# EAGLE design LB_BIT_1OUT-XL-v03(1_1x) (EAGLE 6.5.0)
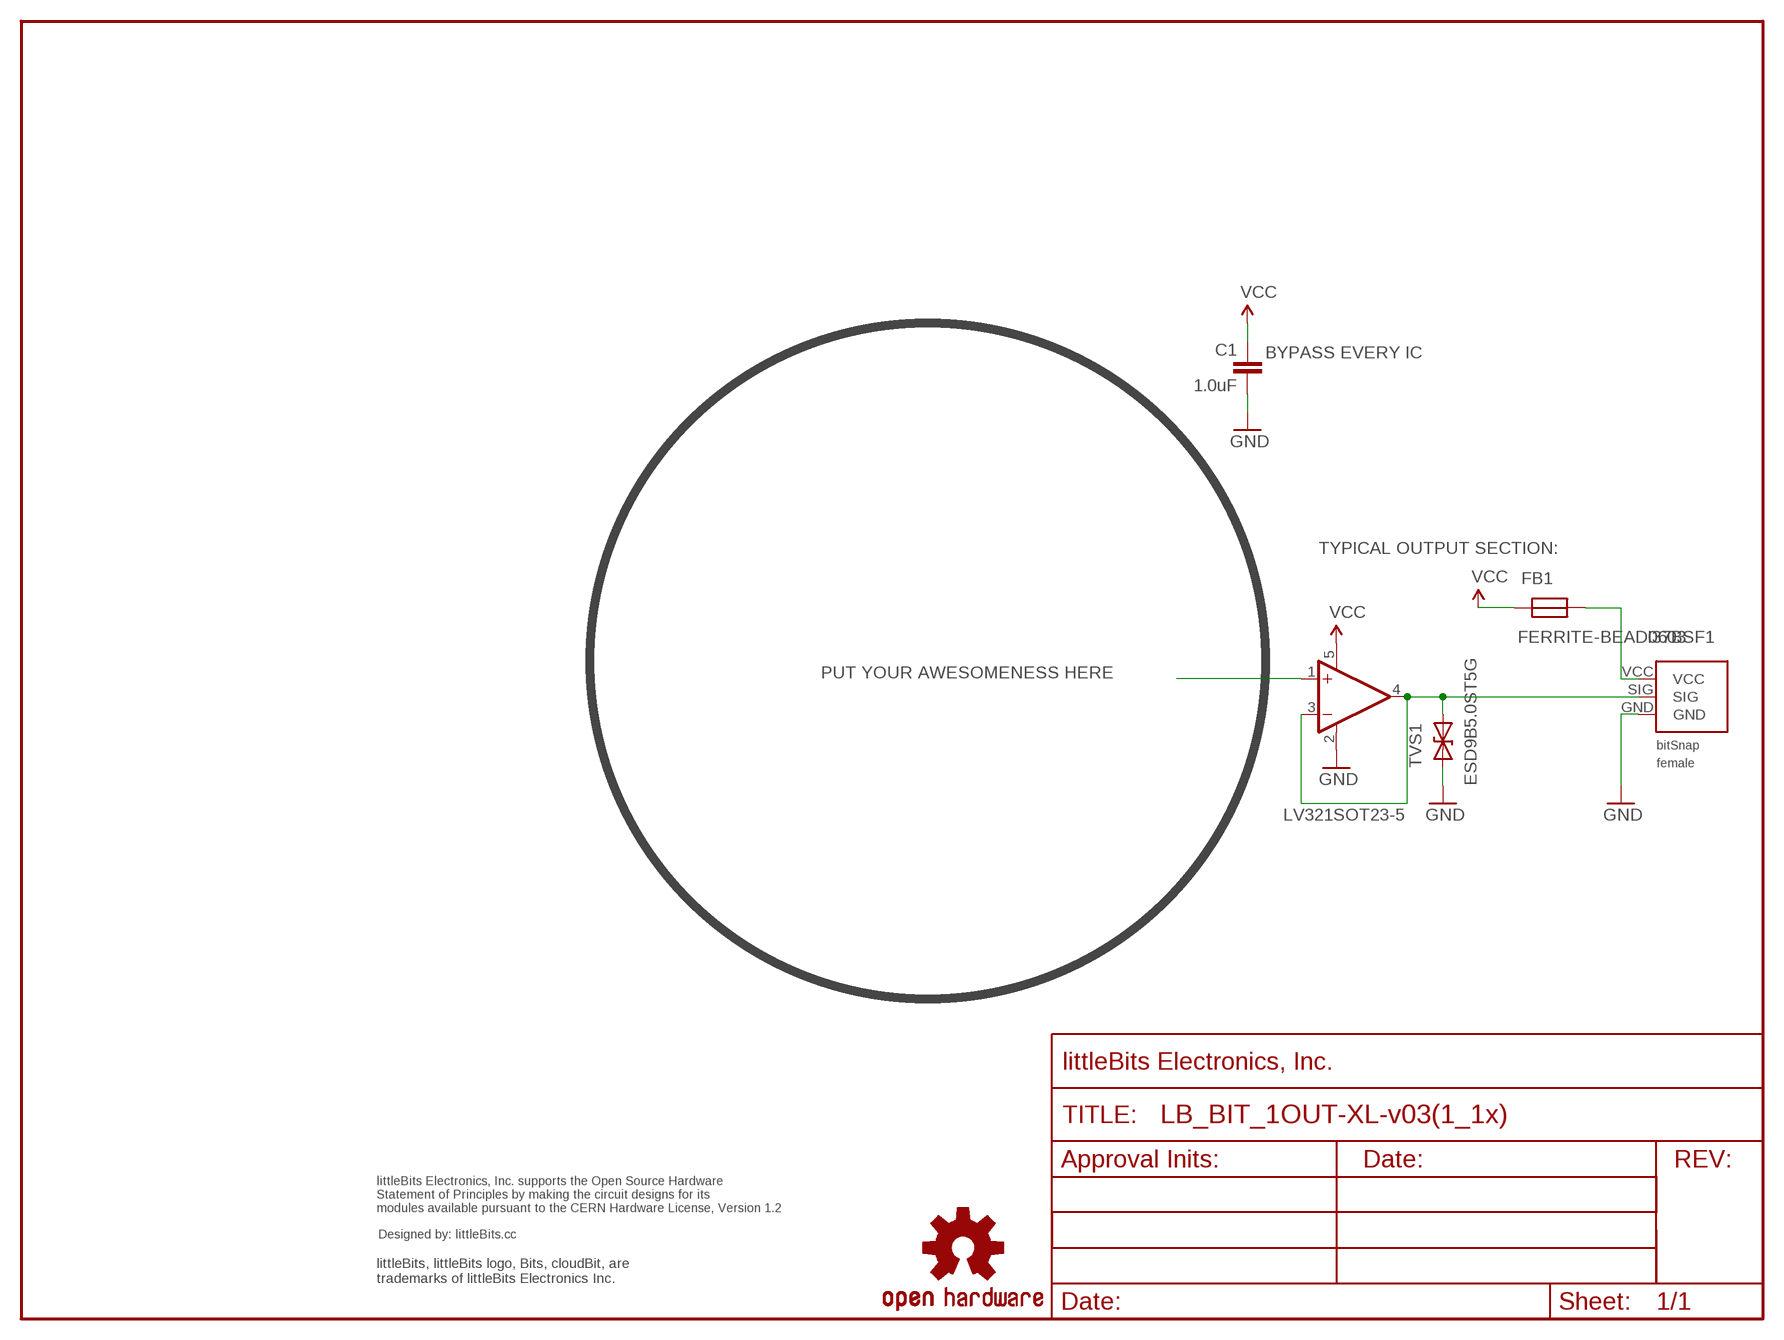
[diagram p0: schematic, sheet 1]

## Parts
C1  1.0uF  CAPCAP-0603  [CAP-0603]
FB1  FERRITE-BEAD0603  [R0603]
FRAME1  FRAME-LETTERWHITEMASK  [FABDWG01-WHITEMASK]
I37BSF1  BITSNAP_V03_FEMALE  [BITSNAP_V03_FEMALE]
TVS1  ESD9B5.0ST5G  DIODE-TVSSOD-923  [SOD-923]
U1  LV321SOT23-5  [SOT23-5]
U$1  OSHWCREDIT  [OSHWCREDIT]
U$3  OSHW-LOGOL  [OSHW-LOGO-L]

## Nets
GND: C1.1 I37BSF1.GND TVS1.1(A) U1.2(V-)
N$1: FB1.1 I37BSF1.VCC
N$12: U1.1(+IN)
SIG_OUT: I37BSF1.SIG TVS1.2(C) U1.3(-IN) U1.4(OUT)
VCC: C1.2 FB1.2 U1.5(V+)

## Notes on the sheet
- BYPASS EVERY IC
- TYPICAL OUTPUT SECTION:
- PUT YOUR AWESOMENESS HERE

## Library data of the parts
C1 = LITTLEBITS:CAP
FB1 = LITTLEBITS:FERRITE-BEAD
FRAME1 = LITTLEBITS:FRAME-LETTER: Schematic Frame Standard 8.5x11 US Letter frame
I37BSF1 = bitSnap:BITSNAP_V03_FEMALE
TVS1 = LITTLEBITS:DIODE-TVS: Bidirectional Transient Voltage Suppression Diode: Device conducts in avalanche mode after reaching a part dependent voltage threshold. Used for limiting voltage spikes on ESD sensitive inputs and outputs.; IEC_ESD_PROT0: +/-18kV; LB_PN: ?; MPN: ESD9B5.0ST5G; V_CLAMP: ?; V_OPERATION: 5V
U1 = LITTLEBITS:LV321
U$1 = LITTLEBITS:OSHWCREDIT
U$3 = SparkFun:OSHW-LOGO: Open Source Hardware Logo This logo indicates the piece of hardware it is found on incorporates a OSHW license and/or adheres to the definition of open source hardware found here: http://freedomdefined.org/OSHW

## Board
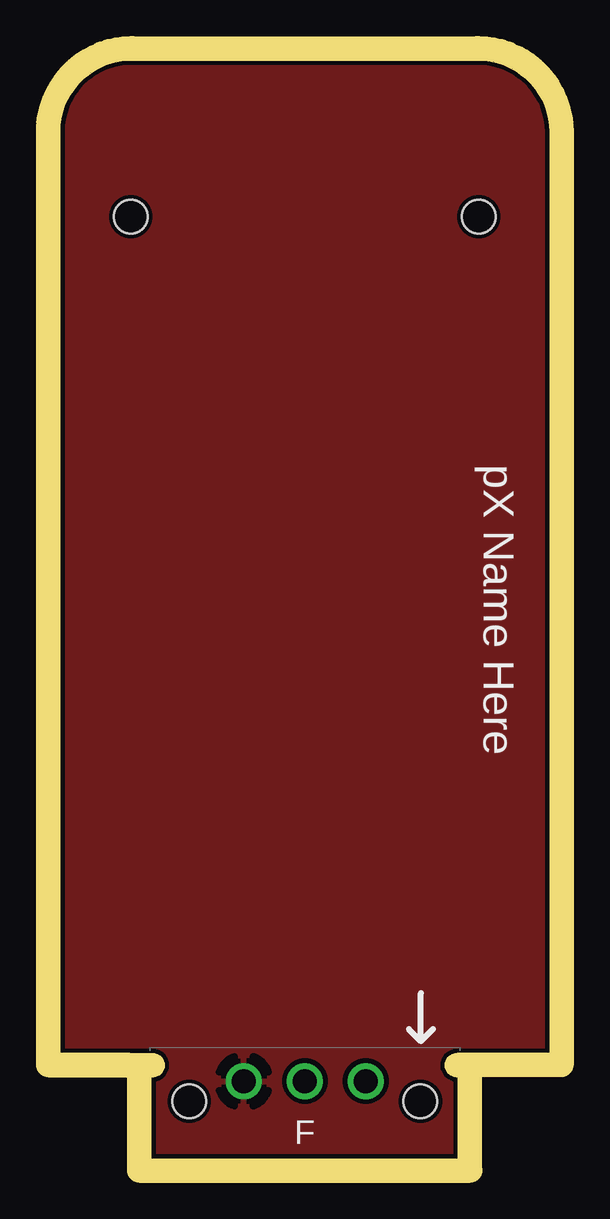
[diagram p1: board, top side]
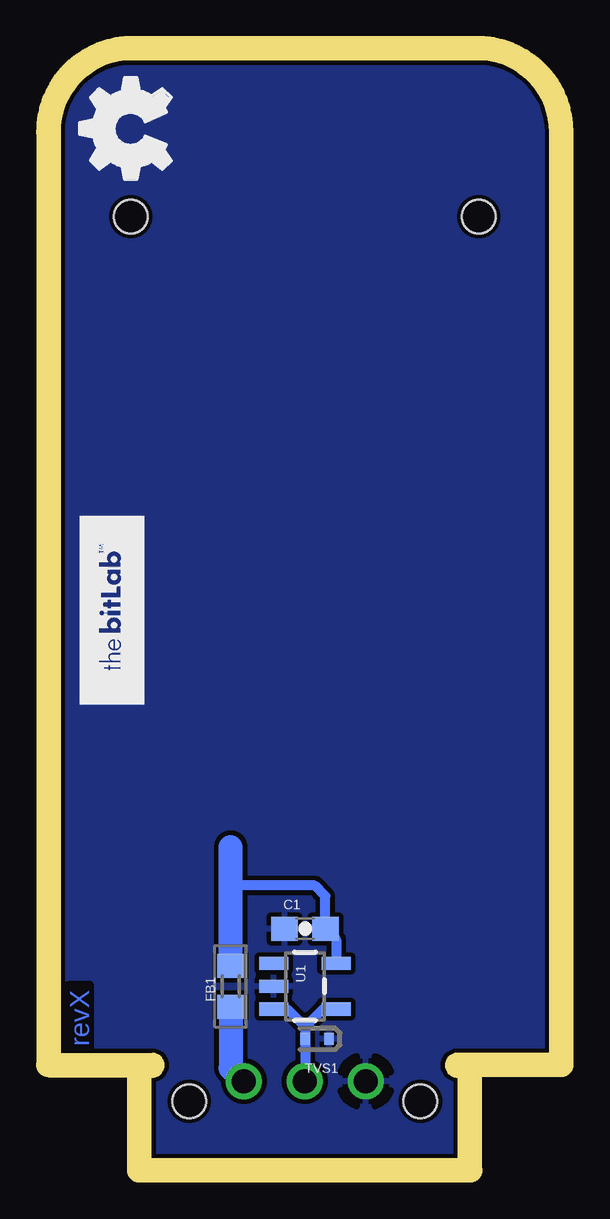
[diagram p2: board, bottom side, seen from below]

Size 20.4 x 45.8 mm. Coordinates in mm from the lower left corner, seen from the top.
Outline: 2.9,4.4 0,4.4 0,42.8 arc-90 3,45.8 17.4,45.8 arc-90 20.4,42.8 20.4,4.4
Copper layers (1*16): Top 0.035mm / dielectric 1.5mm / Bottom 0.035mm
Design rules "littleBitsDRC": minimum track width 0.2mm, minimum drill 0.4mm, track to track 0.2mm, track to pad 0.2mm, pad to pad 0.2mm, via to via 0.2mm, smd to smd 0mil, copper to edge 0.2mm, drill to drill 0.2mm, minimum pad ring 0.2mm, minimum via ring 0.15mm, stop-mask expansion 0.1mm, vias tented up to drill 0mil, thermal gap 0.2mm
Milling: 7 lines

### Footprints (pad centres in the part's own frame; a part is rotated, then mirrored left to right if it is on the bottom)
CAP-0603 = smd 1.1 x 1: 1 -0.85,0; 2 0.85,0
R0603 = smd 1 x 1.1: 1 -0.85,0; 2 0.85,0
BITSNAP_V03_FEMALE = drill 1: GND 4.065,3.44; SIG 6.605,3.44; VCC 9.145,3.44 | hole 1.4: 1.785,2.61; 11.425,2.61
SOD-923 = smd 0.4 x 0.5: 1 -0.5,0; 2 0.5,0
SOT23-5 = smd 0.55 x 1.2: 1 -0.95,-1.3; 2 0,-1.3; 3 0.95,-1.3; 4 0.95,1.3; 5 -0.95,1.3
LB_PWR_LEGS = hole 1.4: -0.645,-0.15; 13.855,-0.15

### Placement (x,y rotation side)
C1  10.19,9.59 0 bottom
FB1  13.29,7.19 90 bottom
FRAME1  -3.01,-0.21 0 top  (outside the outline)
I37BSF1  3.6,-0.21 0 top
TVS1  9.69,4.99 180 bottom
U1  10.19,7.19 270 bottom
U$1  -97.56,-61.98 0 top  (outside the outline)
U$2  [BITLAB-LOGO]  16.89,26.79 270 top
U$3  -39.95,-67.46 0 top  (outside the outline)
U$4  [LB_PWR_LEGS]  3.6,39.42 0 top
U$8  [OSHW_FILLX150_NOTEXT]  15.77,39.98 0 top

### Tracks (layer width: path | path; a pad name or v marks a point on that pad's centre or on a via)
GND
  pour Top: 0.02,-0.07 0.02,45.82 20.41,45.82 20.41,-0.07
  pour Bottom: 0.02,-0.07 0.02,45.82 20.41,45.82 20.41,-0.07
N$1
  Bottom 1: FB1.1 13.29,3.78 I37BSF1.VCC
SIG_OUT
  Bottom 0.406: U1.4 9.44,6.24 10.19,5.49 | 10.19,5.49 TVS1.2 I37BSF1.SIG | U1.3 10.94,6.24 10.19,5.49
VCC
  Bottom 0.406: 13.29,11.39 9.79,11.39 9.34,10.94 C1.2 8.89,9.14 U1.5
  Bottom 1: FB1.2 13.29,11.39 13.29,12.99

### Text on the board
Bottom: revX
tPlace: pX Name Here
Milling: 1mm DIA. ROUTER PATH